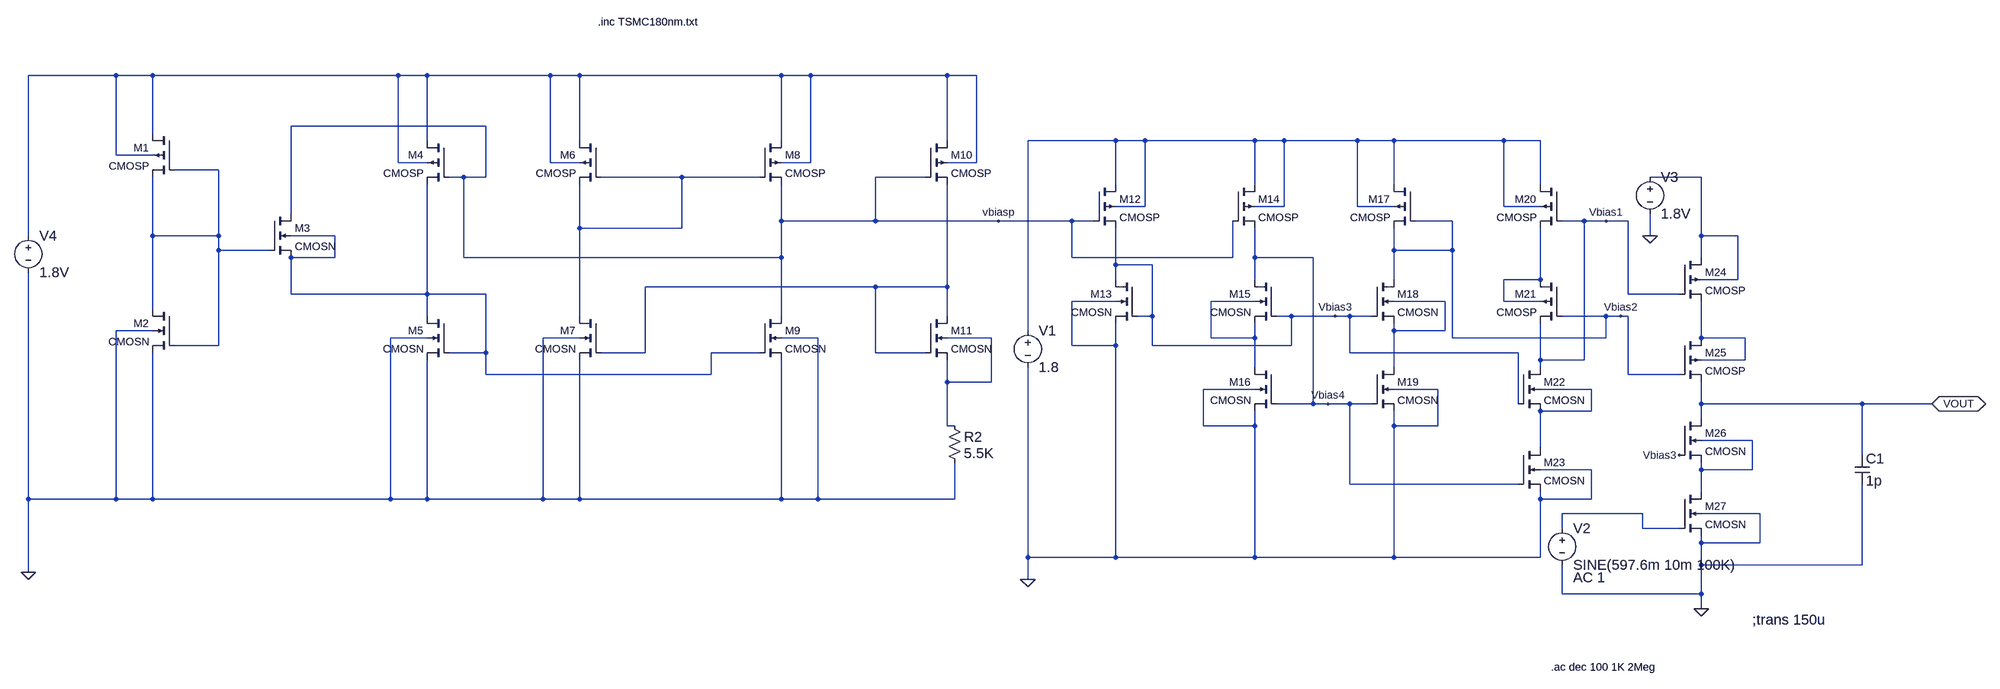
[diagram p0: schematic ckt180nm.asc]
ckt180nm.asc, the LTspice schematic file:
Version 4
SHEET 1 6792 2132
WIRE -496 -608 -688 -608
WIRE -416 -608 -496 -608
WIRE 320 -608 -416 -608
WIRE 384 -608 320 -608
WIRE 656 -608 384 -608
WIRE 720 -608 656 -608
WIRE 1168 -608 720 -608
WIRE 1232 -608 1168 -608
WIRE 1584 -608 1232 -608
WIRE 1648 -608 1584 -608
WIRE 512 -416 -32 -416
WIRE -416 -400 -416 -608
WIRE 384 -384 384 -608
WIRE 720 -384 720 -608
WIRE 1168 -384 1168 -608
WIRE 1584 -384 1584 -608
WIRE 1952 -384 1760 -384
WIRE 2016 -384 1952 -384
WIRE 2256 -384 2016 -384
WIRE 2320 -384 2256 -384
WIRE 2480 -384 2320 -384
WIRE 2560 -384 2480 -384
WIRE 2800 -384 2560 -384
WIRE 2880 -384 2800 -384
WIRE -496 -352 -496 -608
WIRE -416 -352 -496 -352
WIRE 320 -336 320 -608
WIRE 384 -336 320 -336
WIRE 656 -336 656 -608
WIRE 720 -336 656 -336
WIRE 1232 -336 1232 -608
WIRE 1232 -336 1168 -336
WIRE 1648 -336 1648 -608
WIRE 1648 -336 1584 -336
WIRE -272 -320 -368 -320
WIRE 464 -304 432 -304
WIRE 512 -304 512 -416
WIRE 512 -304 464 -304
WIRE 944 -304 768 -304
WIRE 1120 -304 944 -304
WIRE 1536 -304 1392 -304
WIRE 3232 -304 3120 -304
WIRE 1952 -288 1952 -384
WIRE 2256 -288 2256 -384
WIRE 2560 -288 2560 -384
WIRE 2880 -288 2880 -384
WIRE 2016 -240 2016 -384
WIRE 2016 -240 1952 -240
WIRE 2320 -240 2320 -384
WIRE 2320 -240 2256 -240
WIRE 2480 -240 2480 -384
WIRE 2560 -240 2480 -240
WIRE 2800 -240 2800 -384
WIRE 2880 -240 2800 -240
WIRE -32 -224 -32 -416
WIRE 1168 -208 1168 -288
WIRE 1392 -208 1392 -304
WIRE 1392 -208 1168 -208
WIRE 1696 -208 1392 -208
WIRE 1856 -208 1696 -208
WIRE 1904 -208 1856 -208
WIRE 2688 -208 2608 -208
WIRE 2976 -208 2928 -208
WIRE 3024 -208 2976 -208
WIRE 3072 -208 3024 -208
WIRE 720 -192 720 -288
WIRE 944 -192 944 -304
WIRE 944 -192 720 -192
WIRE -688 -176 -688 -608
WIRE -416 -176 -416 -304
WIRE -272 -176 -272 -320
WIRE -272 -176 -416 -176
WIRE 64 -176 -32 -176
WIRE 3120 -176 3120 -224
WIRE 3232 -176 3232 -304
WIRE 3312 -176 3232 -176
WIRE -272 -144 -272 -176
WIRE -80 -144 -272 -144
WIRE 2560 -144 2560 -192
WIRE 2688 -144 2688 -208
WIRE 2688 -144 2560 -144
WIRE 64 -128 64 -176
WIRE 64 -128 -32 -128
WIRE 464 -128 464 -304
WIRE 1168 -128 1168 -208
WIRE 1168 -128 464 -128
WIRE 1856 -128 1856 -208
WIRE 2208 -128 2208 -208
WIRE 2208 -128 1856 -128
WIRE 2256 -128 2256 -192
WIRE 2384 -128 2256 -128
WIRE 3232 -128 3232 -176
WIRE 1952 -112 1952 -192
WIRE 2032 -112 1952 -112
WIRE 1952 -80 1952 -112
WIRE 2256 -80 2256 -128
WIRE 2560 -80 2560 -144
WIRE 2880 -80 2880 -192
WIRE 2880 -80 2800 -80
WIRE 3312 -80 3312 -176
WIRE 3312 -80 3232 -80
WIRE 1392 -64 864 -64
WIRE 1584 -64 1584 -288
WIRE 1584 -64 1392 -64
WIRE -32 -48 -32 -128
WIRE 384 -48 384 -288
WIRE 384 -48 -32 -48
WIRE 512 -48 384 -48
WIRE 3072 -48 3072 -208
WIRE 3184 -48 3072 -48
WIRE 1952 -32 1856 -32
WIRE 2256 -32 2160 -32
WIRE 2672 -32 2560 -32
WIRE 2800 -32 2800 -80
WIRE 2880 -32 2800 -32
WIRE -416 -16 -416 -176
WIRE 384 0 384 -48
WIRE 720 0 720 -192
WIRE 1168 0 1168 -128
WIRE 1584 0 1584 -64
WIRE 2032 0 2032 -112
WIRE 2032 0 2000 0
WIRE 2336 0 2304 0
WIRE 2432 0 2336 0
WIRE 2464 0 2432 0
WIRE 2512 0 2464 0
WIRE 3024 0 2928 0
WIRE 3056 0 3024 0
WIRE 3072 0 3056 0
WIRE -416 32 -496 32
WIRE 1760 32 1760 -384
WIRE 2560 32 2560 16
WIRE 2672 32 2672 -32
WIRE 2672 32 2560 32
WIRE 384 48 304 48
WIRE 720 48 640 48
WIRE 1248 48 1168 48
WIRE 1680 48 1584 48
WIRE 2160 48 2160 -32
WIRE 2256 48 2256 16
WIRE 2256 48 2160 48
WIRE 2688 48 2688 -144
WIRE 3024 48 3024 0
WIRE 3024 48 2688 48
WIRE 3232 48 3232 -32
WIRE 3328 48 3232 48
WIRE -272 64 -272 -144
WIRE -272 64 -368 64
WIRE 1856 64 1856 -32
WIRE 1952 64 1952 16
WIRE 1952 64 1856 64
WIRE 2032 64 2032 0
WIRE 2336 64 2336 0
WIRE 2336 64 2032 64
WIRE 512 80 512 -48
WIRE 512 80 432 80
WIRE 864 80 864 -64
WIRE 864 80 768 80
WIRE 1120 80 1008 80
WIRE 1392 80 1392 -64
WIRE 1536 80 1392 80
WIRE 2464 80 2464 0
WIRE 2832 80 2464 80
WIRE 2880 96 2880 16
WIRE 2976 96 2976 -208
WIRE 2976 96 2880 96
WIRE 3328 96 3328 48
WIRE 3328 96 3232 96
WIRE 2256 112 2256 48
WIRE 2560 112 2560 32
WIRE 2880 112 2880 96
WIRE 512 128 512 80
WIRE 1008 128 1008 80
WIRE 1008 128 512 128
WIRE 3072 128 3072 0
WIRE 3184 128 3072 128
WIRE 1584 144 1584 96
WIRE 1680 144 1680 48
WIRE 1680 144 1584 144
WIRE 2256 160 2144 160
WIRE 2656 160 2560 160
WIRE 2992 160 2880 160
WIRE 2384 192 2384 -128
WIRE 2384 192 2304 192
WIRE 2416 192 2384 192
WIRE 2464 192 2416 192
WIRE 2512 192 2464 192
WIRE 2832 192 2832 80
WIRE 3232 192 3232 144
WIRE 3584 192 3232 192
WIRE 3808 192 3584 192
WIRE 2992 208 2992 160
WIRE 2992 208 2880 208
WIRE 3232 224 3232 192
WIRE 1584 240 1584 144
WIRE 1600 240 1584 240
WIRE 2144 240 2144 160
WIRE 2256 240 2256 208
WIRE 2256 240 2144 240
WIRE 2560 240 2560 208
WIRE 2656 240 2656 160
WIRE 2656 240 2560 240
WIRE 3344 272 3232 272
WIRE 2880 288 2880 208
WIRE 3584 304 3584 192
WIRE 2992 336 2880 336
WIRE 3232 336 3232 320
WIRE 3344 336 3344 272
WIRE 3344 336 3232 336
WIRE 2464 368 2464 192
WIRE 2832 368 2464 368
WIRE 3232 384 3232 336
WIRE -688 400 -688 -96
WIRE -496 400 -496 32
WIRE -496 400 -688 400
WIRE -416 400 -416 80
WIRE -416 400 -496 400
WIRE 304 400 304 48
WIRE 304 400 -416 400
WIRE 384 400 384 96
WIRE 384 400 304 400
WIRE 640 400 640 48
WIRE 640 400 384 400
WIRE 720 400 720 96
WIRE 720 400 640 400
WIRE 1168 400 1168 96
WIRE 1168 400 720 400
WIRE 1248 400 1248 48
WIRE 1248 400 1168 400
WIRE 1600 400 1600 320
WIRE 1600 400 1248 400
WIRE 2880 400 2880 384
WIRE 2992 400 2992 336
WIRE 2992 400 2880 400
WIRE 3104 432 2928 432
WIRE 3360 432 3232 432
WIRE 2928 464 2928 432
WIRE 3104 464 3104 432
WIRE 3184 464 3104 464
WIRE 3232 496 3232 480
WIRE 3360 496 3360 432
WIRE 3360 496 3232 496
WIRE 1760 528 1760 112
WIRE 1952 528 1952 64
WIRE 1952 528 1760 528
WIRE 2256 528 2256 240
WIRE 2256 528 1952 528
WIRE 2560 528 2560 240
WIRE 2560 528 2256 528
WIRE 2880 528 2880 400
WIRE 2880 528 2560 528
WIRE 3232 544 3232 496
WIRE 3584 544 3584 368
WIRE 3584 544 3232 544
WIRE -688 560 -688 400
WIRE 1760 576 1760 528
WIRE 2928 608 2928 544
WIRE 3232 608 3232 544
WIRE 3232 608 2928 608
WIRE 3232 640 3232 608
FLAG 3120 -176 0
FLAG 3232 640 0
FLAG 3184 304 Vbias3
FLAG 1760 576 0
FLAG 2432 0 Vbias3
FLAG 2416 192 Vbias4
FLAG 3808 192 VOUT
IOPIN 3808 192 BiDir
FLAG 1696 -208 vbiasp
FLAG 3024 -208 Vbias1
FLAG 3056 0 Vbias2
FLAG -688 560 0
SYMBOL pmos4 3184 -128 R0
SYMATTR InstName M24
SYMATTR Value CMOSP
SYMATTR Value2 l=180n w=2160n
SYMBOL pmos4 3184 48 R0
SYMATTR InstName M25
SYMATTR Value CMOSP
SYMATTR Value2 l=180n w=2160n
SYMBOL nmos4 3184 224 R0
SYMATTR InstName M26
SYMATTR Value CMOSN
SYMATTR Value2 l=180n w=1080n
SYMBOL nmos4 3184 384 R0
SYMATTR InstName M27
SYMATTR Value CMOSN
SYMATTR Value2 l=180n w=1080n
SYMBOL voltage 3120 -320 R0
WINDOW 123 0 0 Left 0
WINDOW 39 0 0 Left 0
WINDOW 0 24 16 Left 3
WINDOW 3 24 96 Left 3
SYMATTR InstName V3
SYMATTR Value 1.8V
SYMBOL cap 3568 304 R0
WINDOW 0 24 8 Left 3
WINDOW 3 24 56 Left 3
SYMATTR InstName C1
SYMATTR Value 1p
SYMBOL voltage -688 -192 R0
WINDOW 123 0 0 Left 0
WINDOW 39 0 0 Left 0
WINDOW 0 24 16 Left 3
WINDOW 3 24 96 Left 3
SYMATTR InstName V4
SYMATTR Value 1.8V
SYMBOL nmos4 -368 -16 M0
SYMATTR InstName M2
SYMATTR Value CMOSN
SYMATTR Value2 l=360n w=1800n
SYMBOL nmos4 -80 -224 R0
SYMATTR InstName M3
SYMATTR Value CMOSN
SYMATTR Value2 l=360n w=720n
SYMBOL pmos4 -368 -400 M0
SYMATTR InstName M1
SYMATTR Value CMOSP
SYMATTR Value2 l=3600n w=1800n
SYMBOL nmos4 432 0 M0
SYMATTR InstName M5
SYMATTR Value CMOSN
SYMATTR Value2 l=360n w=1800n
SYMBOL pmos4 432 -384 M0
SYMATTR InstName M4
SYMATTR Value CMOSP
SYMATTR Value2 l=360n w=4320n
SYMBOL nmos4 768 0 M0
SYMATTR InstName M7
SYMATTR Value CMOSN
SYMATTR Value2 l=360n w=1800n
SYMBOL pmos4 768 -384 M0
SYMATTR InstName M6
SYMATTR Value CMOSP
SYMATTR Value2 l=360n w=4320n
SYMBOL nmos4 1536 0 R0
SYMATTR InstName M11
SYMATTR Value CMOSN
SYMATTR Value2 l=360n w=5400n
SYMBOL pmos4 1536 -384 R0
SYMATTR InstName M10
SYMATTR Value CMOSP
SYMATTR Value2 l=360n w=4320n
SYMBOL nmos4 1120 0 R0
SYMATTR InstName M9
SYMATTR Value CMOSN
SYMATTR Value2 l=360n w=1800n
SYMBOL pmos4 1120 -384 R0
SYMATTR InstName M8
SYMATTR Value CMOSP
SYMATTR Value2 l=360n w=4320n
SYMBOL res 1584 224 R0
WINDOW 0 36 40 Left 3
WINDOW 3 36 76 Left 3
SYMATTR InstName R2
SYMATTR Value 5.5K
SYMBOL pmos4 1904 -288 R0
SYMATTR InstName M12
SYMATTR Value CMOSP
SYMATTR Value2 l=360n w=4320n
SYMBOL nmos4 2000 -80 M0
SYMATTR InstName M13
SYMATTR Value CMOSN
SYMATTR Value2 l=360n w=900n
SYMBOL pmos4 2208 -288 R0
SYMATTR InstName M14
SYMATTR Value CMOSP
SYMATTR Value2 l=360n w=4320n
SYMBOL nmos4 2304 -80 M0
SYMATTR InstName M15
SYMATTR Value CMOSN
SYMATTR Value2 l=360n w=1800n
SYMBOL nmos4 2304 112 M0
SYMATTR InstName M16
SYMATTR Value CMOSN
SYMATTR Value2 l=360n w=1800n
SYMBOL pmos4 2608 -288 M0
SYMATTR InstName M17
SYMATTR Value CMOSP
SYMATTR Value2 l=900n w=3600n
SYMBOL nmos4 2512 -80 R0
SYMATTR InstName M18
SYMATTR Value CMOSN
SYMATTR Value2 l=360n w=1800n
SYMBOL nmos4 2512 112 R0
SYMATTR InstName M19
SYMATTR Value CMOSN
SYMATTR Value2 l=360n w=1800n
SYMBOL pmos4 2928 -288 M0
SYMATTR InstName M20
SYMATTR Value CMOSP
SYMATTR Value2 l=360n w=4320n
SYMBOL nmos4 2832 112 R0
SYMATTR InstName M22
SYMATTR Value CMOSN
SYMATTR Value2 l=360n w=1800n
SYMBOL nmos4 2832 288 R0
SYMATTR InstName M23
SYMATTR Value CMOSN
SYMATTR Value2 l=360n w=1800n
SYMBOL voltage 1760 16 R0
WINDOW 123 0 0 Left 0
WINDOW 39 0 0 Left 0
WINDOW 0 24 16 Left 3
WINDOW 3 24 96 Left 3
SYMATTR InstName V1
SYMATTR Value 1.8
SYMBOL pmos4 2928 -80 M0
SYMATTR InstName M21
SYMATTR Value CMOSP
SYMATTR Value2 l=360n w=4320n
SYMBOL voltage 2928 448 R0
WINDOW 123 24 124 Left 3
WINDOW 39 0 0 Left 0
WINDOW 0 24 16 Left 3
WINDOW 3 24 96 Left 3
SYMATTR Value2 AC 1
SYMATTR InstName V2
SYMATTR Value SINE(597.6m 10m 100K)
TEXT 760 -1696 Left 2 !.inc TSMC180nm.txt
TEXT 2904 768 Left 2 !.ac dec 100 1K 2Meg
TEXT 3344 664 Left 3 !;trans 150u

The netlist it stands for:
* ckt180nm.asc
M24 N005 Vbias1 N012 N005 CMOSP l=180n w=2160n
M25 N012 Vbias2 VOUT N012 CMOSP l=180n w=2160n
M26 VOUT Vbias3 N014 N014 CMOSN l=180n w=1080n
M27 N014 N015 0 0 CMOSN l=180n w=1080n
V3 N005 0 1.8V
C1 VOUT 0 1p
V4 N001 0 1.8V
M2 N003 N003 0 0 CMOSN l=360n w=1800n
M3 vbiasp N003 N006 N006 CMOSN l=360n w=720n
M1 N001 N003 N003 N001 CMOSP l=3600n w=1800n
M5 N006 N006 0 0 CMOSN l=360n w=1800n
M4 N001 vbiasp N006 N001 CMOSP l=360n w=4320n
M7 N004 N008 0 0 CMOSN l=360n w=1800n
M6 N001 N004 N004 N001 CMOSP l=360n w=4320n
M11 N008 N008 N011 N011 CMOSN l=360n w=5400n
M10 N001 vbiasp N008 N001 CMOSP l=360n w=4320n
M9 vbiasp N006 0 0 CMOSN l=360n w=1800n
M8 N001 N004 vbiasp N001 CMOSP l=360n w=4320n
R2 N011 0 5.5K
M12 N002 vbiasp Vbias3 N002 CMOSP l=360n w=4320n
M13 Vbias3 Vbias3 0 0 CMOSN l=360n w=900n
M14 N002 vbiasp Vbias4 N002 CMOSP l=360n w=4320n
M15 Vbias4 Vbias3 N009 N009 CMOSN l=360n w=1800n
M16 N009 Vbias4 0 0 CMOSN l=360n w=1800n
M17 N002 Vbias2 Vbias2 N002 CMOSP l=900n w=3600n
M18 Vbias2 Vbias3 N010 N010 CMOSN l=360n w=1800n
M19 N010 Vbias4 0 0 CMOSN l=360n w=1800n
M20 N002 Vbias1 N007 N002 CMOSP l=360n w=4320n
M22 Vbias1 Vbias3 N013 N013 CMOSN l=360n w=1800n
M23 N013 Vbias4 0 0 CMOSN l=360n w=1800n
V1 N002 0 1.8
M21 N007 Vbias2 Vbias1 N007 CMOSP l=360n w=4320n
V2 N015 0 SINE(597.6m 10m 100K) AC 1
.model NMOS NMOS
.model PMOS PMOS
.lib standard.mos
.inc TSMC180nm.txt
.ac dec 100 1K 2Meg
;trans 150u
.backanno
.end